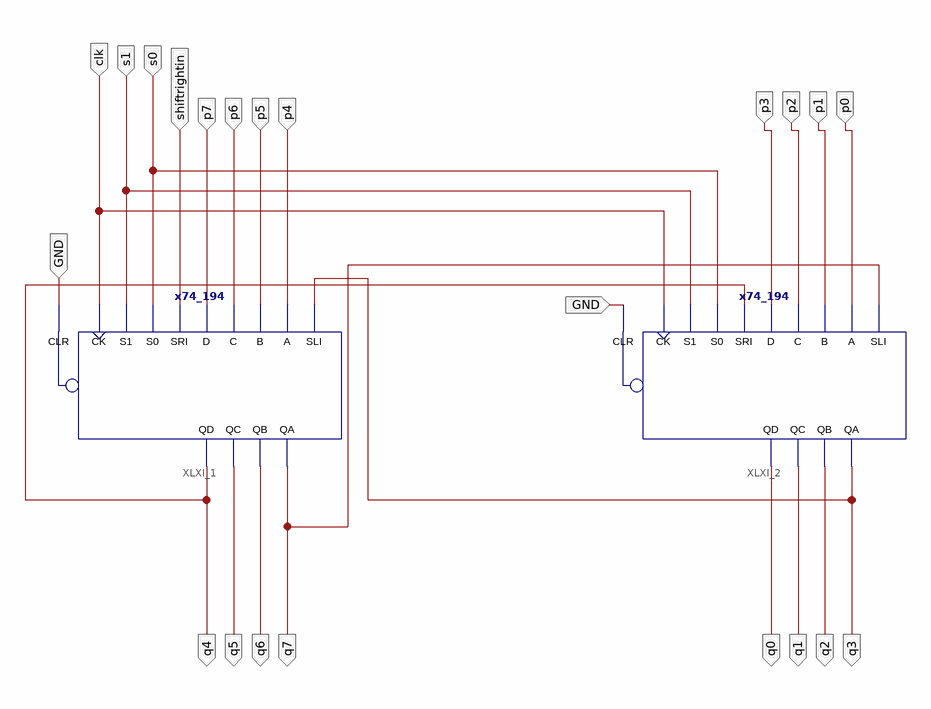
[diagram p0: schematic sheet 1]
// Xilinx ISE schematic lab10_3.sch (xa9500xl) as structural Verilog: 2 symbols, 21 ports
module lab10_3 (
  input  s1,
  input  s0,
  input  clk,
  input  GND,
  input  shiftrightin,
  input  p5,
  input  p4,
  input  p6,
  input  p3,
  input  p2,
  input  p1,
  input  p0,
  input  p7,
  output q0,
  output q5,
  output q6,
  output q1,
  output q2,
  output q3,
  output q4,
  output q7
);

  x74_194 XLXI_1 (
    .A(p4), .B(p5), .C(p6), .CK(clk), .CLR(GND), .D(p7), .S0(s0), .S1(s1), .SLI(q3), .SRI(shiftrightin),
    .QA(q7), .QB(q6), .QC(q5), .QD(q4));
  x74_194 XLXI_2 (
    .A(p0), .B(p1), .C(p2), .CK(clk), .CLR(GND), .D(p3), .S0(s0), .S1(s1), .SLI(q7), .SRI(q4), .QA(q3),
    .QB(q2), .QC(q1), .QD(q0));
endmodule
